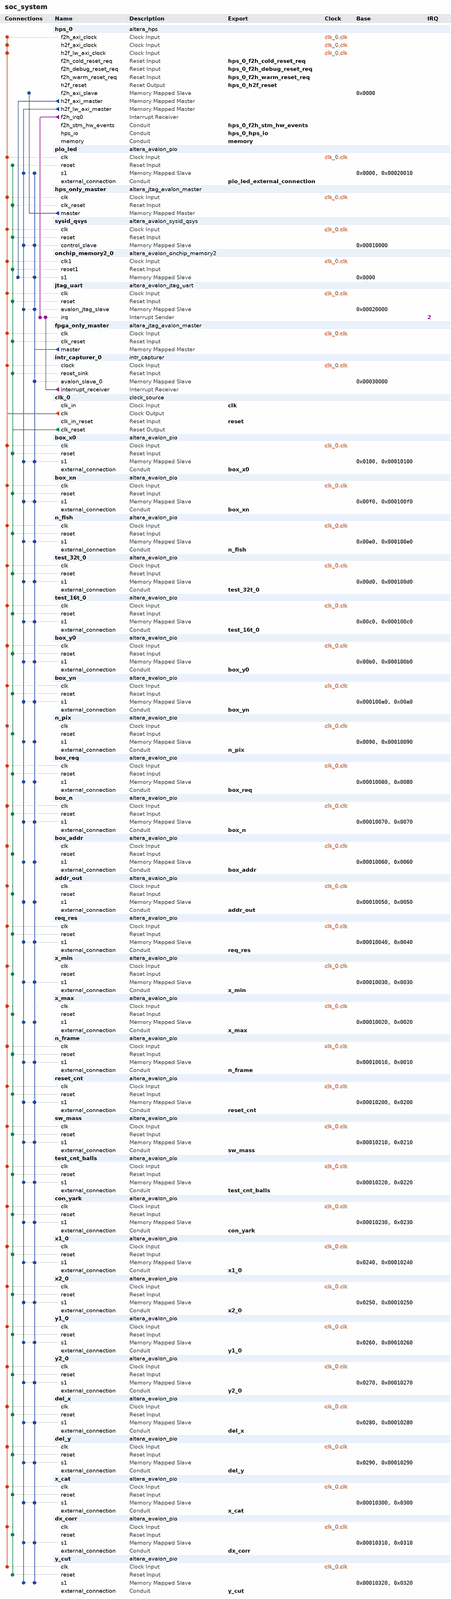
[diagram p0: system contents, whole]
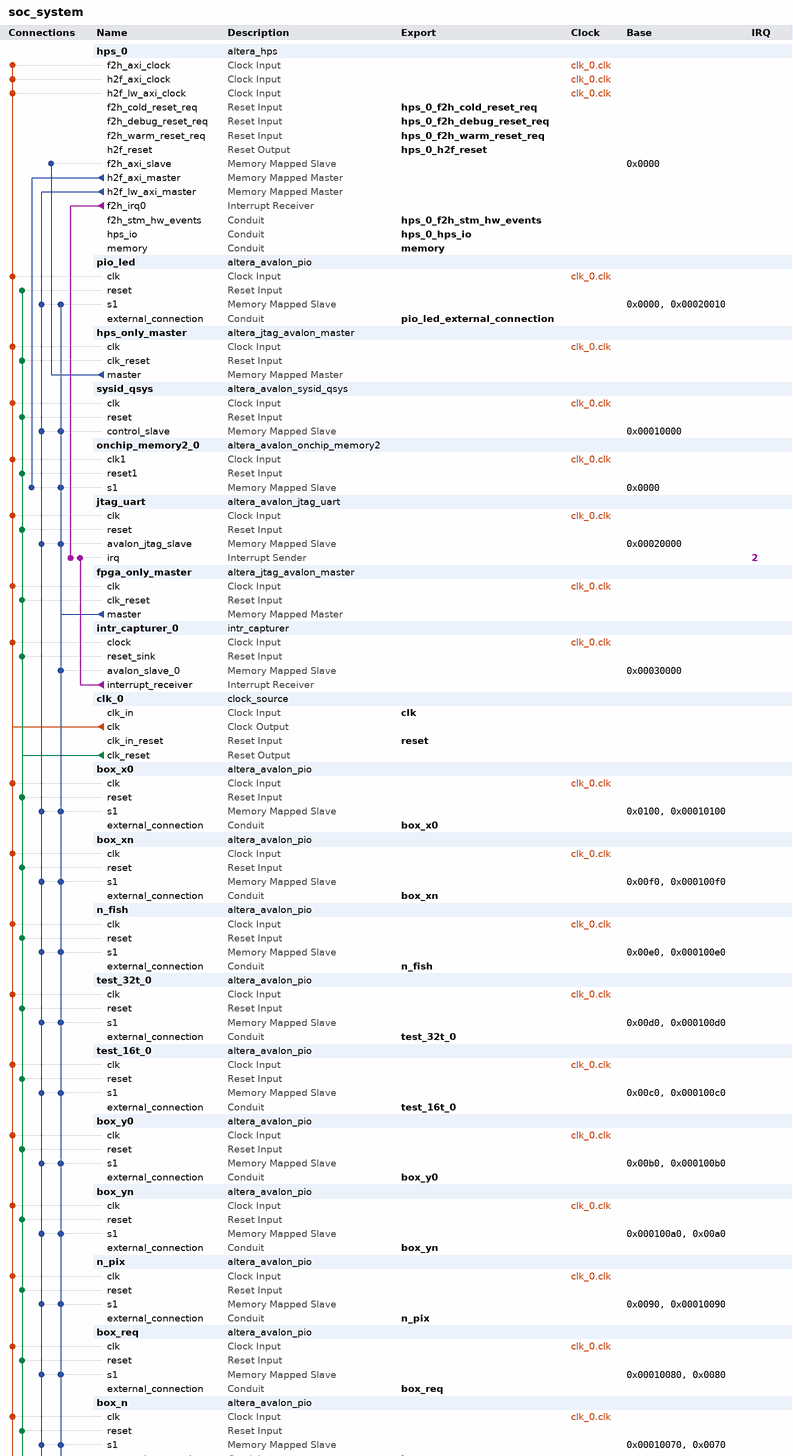
[diagram p1: system contents, upper part]
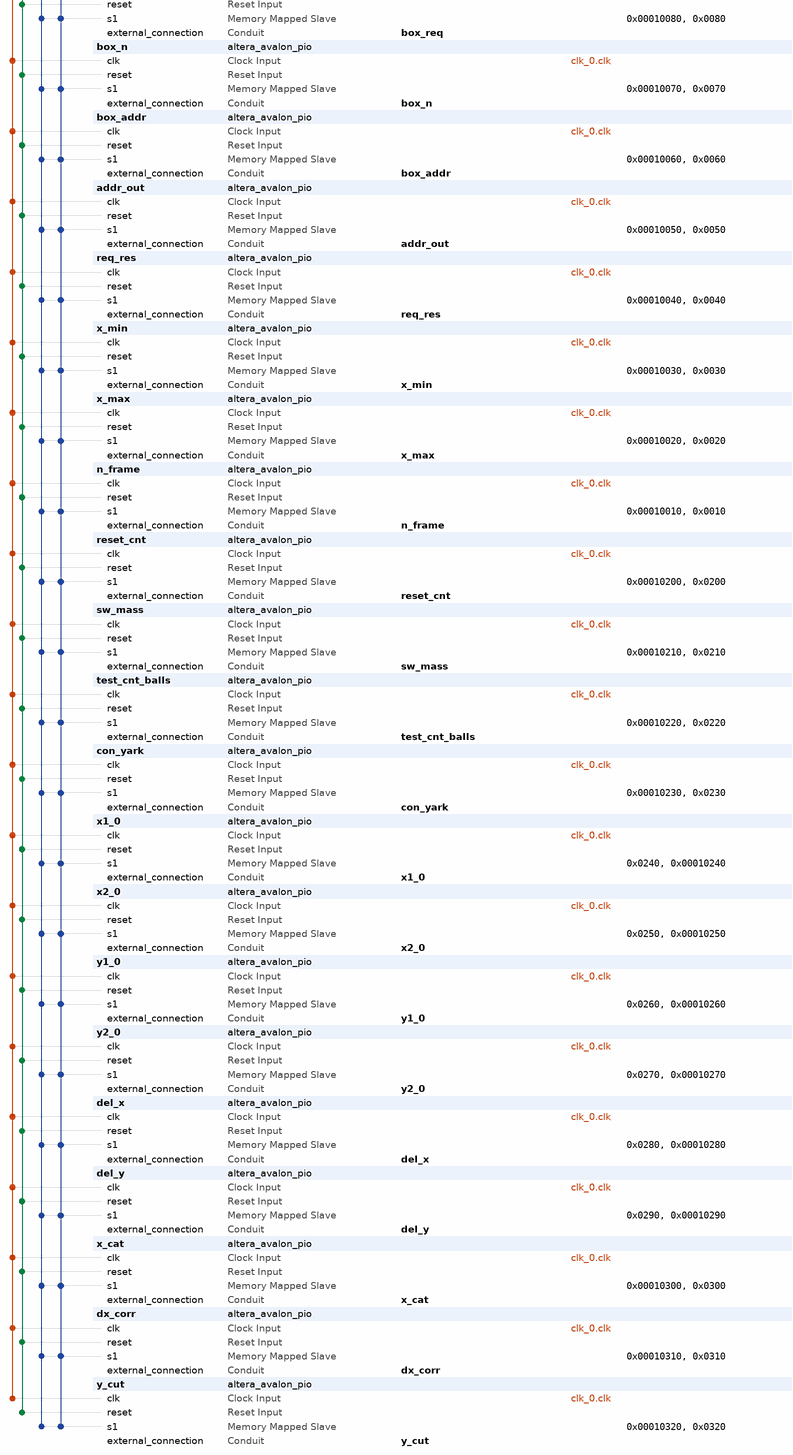
[diagram p2: system contents, lower part]
# Platform Designer (Qsys) system soc_system, Cyclone V 5CSEMA5F31C6
# Parameters at their usual value, and those the tool derives, are not listed.
package require -exact qsys 13.1
create_system soc_system
set_project_property DEVICE_FAMILY {Cyclone V}
set_project_property DEVICE 5CSEMA5F31C6

add_instance hps_0 altera_hps 13.1
set_instance_parameter_value hps_0 MEM_VENDOR JEDEC
set_instance_parameter_value hps_0 MEM_ROW_ADDR_WIDTH 15
set_instance_parameter_value hps_0 MEM_COL_ADDR_WIDTH 10
set_instance_parameter_value hps_0 MEM_DQ_WIDTH 32
set_instance_parameter_value hps_0 MEM_BANKADDR_WIDTH 3
set_instance_parameter_value hps_0 MEM_DRV_STR RZQ/7
set_instance_parameter_value hps_0 MEM_RTT_NOM RZQ/4
set_instance_parameter_value hps_0 MEM_RTT_WR RZQ/4
set_instance_parameter_value hps_0 MEM_WTCL 8
set_instance_parameter_value hps_0 MEM_TCL 11
set_instance_parameter_value hps_0 TIMING_TIS 180
set_instance_parameter_value hps_0 TIMING_TIH 140
set_instance_parameter_value hps_0 TIMING_TDS 30
set_instance_parameter_value hps_0 TIMING_TDH 65
set_instance_parameter_value hps_0 TIMING_TDQSQ 125
set_instance_parameter_value hps_0 TIMING_TDQSCK 255
set_instance_parameter_value hps_0 TIMING_TQSH 0.4
set_instance_parameter_value hps_0 MEM_TRAS_NS 35.0
set_instance_parameter_value hps_0 MEM_TRCD_NS 13.75
set_instance_parameter_value hps_0 MEM_TRP_NS 13.75
set_instance_parameter_value hps_0 MEM_TRFC_NS 260.0
set_instance_parameter_value hps_0 MEM_TFAW_NS 30.0
set_instance_parameter_value hps_0 REF_CLK_FREQ 25.0
set_instance_parameter_value hps_0 DEFAULT_FAST_SIM_MODEL true
set_instance_parameter_value hps_0 TIMING_BOARD_MAX_CK_DELAY 0.03
set_instance_parameter_value hps_0 TIMING_BOARD_MAX_DQS_DELAY 0.02
set_instance_parameter_value hps_0 TIMING_BOARD_SKEW_CKDQS_DIMM_MIN 0.09
set_instance_parameter_value hps_0 TIMING_BOARD_SKEW_CKDQS_DIMM_MAX 0.16
set_instance_parameter_value hps_0 TIMING_BOARD_SKEW_WITHIN_DQS 0.01
set_instance_parameter_value hps_0 TIMING_BOARD_SKEW_BETWEEN_DQS 0.08
set_instance_parameter_value hps_0 TIMING_BOARD_DQ_TO_DQS_SKEW 0.0
set_instance_parameter_value hps_0 TIMING_BOARD_AC_SKEW 0.03
set_instance_parameter_value hps_0 TIMING_BOARD_AC_TO_CK_SKEW 0.0
set_instance_parameter_value hps_0 MEM_CLK_FREQ 400.0
set_instance_parameter_value hps_0 HPS_PROTOCOL DDR3
set_instance_parameter_value hps_0 STM_Enable true
set_instance_parameter_value hps_0 F2S_Width 2
set_instance_parameter_value hps_0 S2F_Width 2
set_instance_parameter_value hps_0 LWH2F_Enable true
set_instance_parameter_value hps_0 F2SCLK_DBGRST_Enable true
set_instance_parameter_value hps_0 F2SCLK_WARMRST_Enable true
set_instance_parameter_value hps_0 F2SCLK_COLDRST_Enable true
set_instance_parameter_value hps_0 F2SINTERRUPT_Enable true
set_instance_parameter_value hps_0 EMAC1_PinMuxing {HPS I/O Set 0}
set_instance_parameter_value hps_0 EMAC1_Mode RGMII
set_instance_parameter_value hps_0 QSPI_PinMuxing {HPS I/O Set 0}
set_instance_parameter_value hps_0 QSPI_Mode {1 SS}
set_instance_parameter_value hps_0 SDIO_PinMuxing {HPS I/O Set 0}
set_instance_parameter_value hps_0 SDIO_Mode {4-bit Data}
set_instance_parameter_value hps_0 USB1_PinMuxing {HPS I/O Set 0}
set_instance_parameter_value hps_0 USB1_Mode SDR
set_instance_parameter_value hps_0 SPIM1_PinMuxing {HPS I/O Set 0}
set_instance_parameter_value hps_0 SPIM1_Mode {Single Slave Select}
set_instance_parameter_value hps_0 UART0_PinMuxing {HPS I/O Set 0}
set_instance_parameter_value hps_0 UART0_Mode {No Flow Control}
set_instance_parameter_value hps_0 I2C0_PinMuxing {HPS I/O Set 0}
set_instance_parameter_value hps_0 I2C0_Mode I2C
set_instance_parameter_value hps_0 I2C1_PinMuxing {HPS I/O Set 0}
set_instance_parameter_value hps_0 I2C1_Mode I2C
set_instance_parameter_value hps_0 S2FCLK_USER1CLK_FREQ 100
set_instance_parameter_value hps_0 FPGA_PERIPHERAL_OUTPUT_CLOCK_FREQ_EMAC0_MD_CLK 100
set_instance_parameter_value hps_0 FPGA_PERIPHERAL_OUTPUT_CLOCK_FREQ_EMAC0_GTX_CLK 100
set_instance_parameter_value hps_0 FPGA_PERIPHERAL_OUTPUT_CLOCK_FREQ_EMAC1_MD_CLK 100
set_instance_parameter_value hps_0 FPGA_PERIPHERAL_OUTPUT_CLOCK_FREQ_EMAC1_GTX_CLK 100

add_instance pio_led altera_avalon_pio 13.1
set_instance_parameter_value pio_led direction Output
set_instance_parameter_value pio_led width 10

add_instance hps_only_master altera_jtag_avalon_master 13.1

add_instance sysid_qsys altera_avalon_sysid_qsys 13.1
set_instance_parameter_value sysid_qsys id -1395322110

add_instance onchip_memory2_0 altera_avalon_onchip_memory2 13.1
set_instance_parameter_value onchip_memory2_0 dataWidth 64
set_instance_parameter_value onchip_memory2_0 dualPort false
set_instance_parameter_value onchip_memory2_0 initMemContent true
set_instance_parameter_value onchip_memory2_0 initializationFileName onchip_memory2_0
set_instance_parameter_value onchip_memory2_0 memorySize 65536

add_instance jtag_uart altera_avalon_jtag_uart 13.1
set_instance_parameter_value jtag_uart allowMultipleConnections true
set_instance_parameter_value jtag_uart simInteractiveOptions INTERACTIVE_ASCII_OUTPUT

add_instance fpga_only_master altera_jtag_avalon_master 13.1

add_instance intr_capturer_0 intr_capturer 100.99.98.97

add_instance clk_0 clock_source 13.1
set_instance_parameter_value clk_0 clockFrequency 56000000

add_instance box_x0 altera_avalon_pio 13.1
set_instance_parameter_value box_x0 captureEdge true
set_instance_parameter_value box_x0 direction Input
set_instance_parameter_value box_x0 edgeType ANY
set_instance_parameter_value box_x0 irqType EDGE
set_instance_parameter_value box_x0 width 16

add_instance box_xn altera_avalon_pio 13.1
set_instance_parameter_value box_xn captureEdge true
set_instance_parameter_value box_xn direction Input
set_instance_parameter_value box_xn edgeType ANY
set_instance_parameter_value box_xn width 16

add_instance n_fish altera_avalon_pio 13.1
set_instance_parameter_value n_fish direction Output
set_instance_parameter_value n_fish width 16

add_instance test_32t_0 altera_avalon_pio 13.1
set_instance_parameter_value test_32t_0 direction Output
set_instance_parameter_value test_32t_0 width 32

add_instance test_16t_0 altera_avalon_pio 13.1
set_instance_parameter_value test_16t_0 direction Output
set_instance_parameter_value test_16t_0 width 16

add_instance box_y0 altera_avalon_pio 13.1
set_instance_parameter_value box_y0 captureEdge true
set_instance_parameter_value box_y0 direction Input
set_instance_parameter_value box_y0 edgeType ANY
set_instance_parameter_value box_y0 irqType EDGE
set_instance_parameter_value box_y0 width 16

add_instance box_yn altera_avalon_pio 13.1
set_instance_parameter_value box_yn captureEdge true
set_instance_parameter_value box_yn direction Input
set_instance_parameter_value box_yn edgeType ANY
set_instance_parameter_value box_yn irqType EDGE
set_instance_parameter_value box_yn width 16

add_instance n_pix altera_avalon_pio 13.1
set_instance_parameter_value n_pix captureEdge true
set_instance_parameter_value n_pix direction Input
set_instance_parameter_value n_pix edgeType ANY
set_instance_parameter_value n_pix irqType EDGE
set_instance_parameter_value n_pix width 32

add_instance box_req altera_avalon_pio 13.1
set_instance_parameter_value box_req captureEdge true
set_instance_parameter_value box_req direction Input
set_instance_parameter_value box_req width 1

add_instance box_n altera_avalon_pio 13.1
set_instance_parameter_value box_n direction Input
set_instance_parameter_value box_n width 8

add_instance box_addr altera_avalon_pio 13.1
set_instance_parameter_value box_addr direction Input
set_instance_parameter_value box_addr width 8

add_instance addr_out altera_avalon_pio 13.1
set_instance_parameter_value addr_out direction Output
set_instance_parameter_value addr_out width 8

add_instance req_res altera_avalon_pio 13.1
set_instance_parameter_value req_res direction Output
set_instance_parameter_value req_res width 1

add_instance x_min altera_avalon_pio 13.1
set_instance_parameter_value x_min direction Input
set_instance_parameter_value x_min width 16

add_instance x_max altera_avalon_pio 13.1
set_instance_parameter_value x_max direction Input
set_instance_parameter_value x_max width 16

add_instance n_frame altera_avalon_pio 13.1
set_instance_parameter_value n_frame direction Input
set_instance_parameter_value n_frame width 32

add_instance reset_cnt altera_avalon_pio 13.1
set_instance_parameter_value reset_cnt direction Input
set_instance_parameter_value reset_cnt width 1

add_instance sw_mass altera_avalon_pio 13.1
set_instance_parameter_value sw_mass direction Input
set_instance_parameter_value sw_mass width 2

add_instance test_cnt_balls altera_avalon_pio 13.1
set_instance_parameter_value test_cnt_balls direction Input
set_instance_parameter_value test_cnt_balls width 1

add_instance con_yark altera_avalon_pio 13.1
set_instance_parameter_value con_yark direction Output
set_instance_parameter_value con_yark width 8

add_instance x1_0 altera_avalon_pio 13.1
set_instance_parameter_value x1_0 direction Output
set_instance_parameter_value x1_0 width 10

add_instance x2_0 altera_avalon_pio 13.1
set_instance_parameter_value x2_0 direction Output
set_instance_parameter_value x2_0 width 10

add_instance y1_0 altera_avalon_pio 13.1
set_instance_parameter_value y1_0 direction Output
set_instance_parameter_value y1_0 width 10

add_instance y2_0 altera_avalon_pio 13.1
set_instance_parameter_value y2_0 direction Output
set_instance_parameter_value y2_0 width 10

add_instance del_x altera_avalon_pio 13.1
set_instance_parameter_value del_x direction Output
set_instance_parameter_value del_x width 10

add_instance del_y altera_avalon_pio 13.1
set_instance_parameter_value del_y direction Output
set_instance_parameter_value del_y width 10

add_instance x_cat altera_avalon_pio 13.1
set_instance_parameter_value x_cat direction Output
set_instance_parameter_value x_cat width 10

add_instance dx_corr altera_avalon_pio 13.1
set_instance_parameter_value dx_corr direction Input
set_instance_parameter_value dx_corr width 10

add_instance y_cut altera_avalon_pio 13.1
set_instance_parameter_value y_cut direction Output
set_instance_parameter_value y_cut width 10

# connections
add_connection clk_0.clk addr_out.clk clock
add_connection clk_0.clk box_addr.clk clock
add_connection clk_0.clk box_n.clk clock
add_connection clk_0.clk box_req.clk clock
add_connection clk_0.clk box_x0.clk clock
add_connection clk_0.clk box_xn.clk clock
add_connection clk_0.clk box_y0.clk clock
add_connection clk_0.clk box_yn.clk clock
add_connection clk_0.clk con_yark.clk clock
add_connection clk_0.clk del_x.clk clock
add_connection clk_0.clk del_y.clk clock
add_connection clk_0.clk dx_corr.clk clock
add_connection clk_0.clk fpga_only_master.clk clock
add_connection clk_0.clk hps_0.f2h_axi_clock clock
add_connection clk_0.clk hps_0.h2f_axi_clock clock
add_connection clk_0.clk hps_0.h2f_lw_axi_clock clock
add_connection clk_0.clk hps_only_master.clk clock
add_connection clk_0.clk intr_capturer_0.clock clock
add_connection clk_0.clk jtag_uart.clk clock
add_connection clk_0.clk n_fish.clk clock
add_connection clk_0.clk n_frame.clk clock
add_connection clk_0.clk n_pix.clk clock
add_connection clk_0.clk onchip_memory2_0.clk1 clock
add_connection clk_0.clk pio_led.clk clock
add_connection clk_0.clk req_res.clk clock
add_connection clk_0.clk reset_cnt.clk clock
add_connection clk_0.clk sw_mass.clk clock
add_connection clk_0.clk sysid_qsys.clk clock
add_connection clk_0.clk test_16t_0.clk clock
add_connection clk_0.clk test_32t_0.clk clock
add_connection clk_0.clk test_cnt_balls.clk clock
add_connection clk_0.clk x1_0.clk clock
add_connection clk_0.clk x2_0.clk clock
add_connection clk_0.clk x_cat.clk clock
add_connection clk_0.clk x_max.clk clock
add_connection clk_0.clk x_min.clk clock
add_connection clk_0.clk y1_0.clk clock
add_connection clk_0.clk y2_0.clk clock
add_connection clk_0.clk y_cut.clk clock
add_connection clk_0.clk_reset addr_out.reset reset
add_connection clk_0.clk_reset box_addr.reset reset
add_connection clk_0.clk_reset box_n.reset reset
add_connection clk_0.clk_reset box_req.reset reset
add_connection clk_0.clk_reset box_x0.reset reset
add_connection clk_0.clk_reset box_xn.reset reset
add_connection clk_0.clk_reset box_y0.reset reset
add_connection clk_0.clk_reset box_yn.reset reset
add_connection clk_0.clk_reset con_yark.reset reset
add_connection clk_0.clk_reset del_x.reset reset
add_connection clk_0.clk_reset del_y.reset reset
add_connection clk_0.clk_reset dx_corr.reset reset
add_connection clk_0.clk_reset fpga_only_master.clk_reset reset
add_connection clk_0.clk_reset hps_only_master.clk_reset reset
add_connection clk_0.clk_reset intr_capturer_0.reset_sink reset
add_connection clk_0.clk_reset jtag_uart.reset reset
add_connection clk_0.clk_reset n_fish.reset reset
add_connection clk_0.clk_reset n_frame.reset reset
add_connection clk_0.clk_reset n_pix.reset reset
add_connection clk_0.clk_reset onchip_memory2_0.reset1 reset
add_connection clk_0.clk_reset pio_led.reset reset
add_connection clk_0.clk_reset req_res.reset reset
add_connection clk_0.clk_reset reset_cnt.reset reset
add_connection clk_0.clk_reset sw_mass.reset reset
add_connection clk_0.clk_reset sysid_qsys.reset reset
add_connection clk_0.clk_reset test_16t_0.reset reset
add_connection clk_0.clk_reset test_32t_0.reset reset
add_connection clk_0.clk_reset test_cnt_balls.reset reset
add_connection clk_0.clk_reset x1_0.reset reset
add_connection clk_0.clk_reset x2_0.reset reset
add_connection clk_0.clk_reset x_cat.reset reset
add_connection clk_0.clk_reset x_max.reset reset
add_connection clk_0.clk_reset x_min.reset reset
add_connection clk_0.clk_reset y1_0.reset reset
add_connection clk_0.clk_reset y2_0.reset reset
add_connection clk_0.clk_reset y_cut.reset reset
add_connection fpga_only_master.master addr_out.s1 avalon
set_connection_parameter_value fpga_only_master.master/addr_out.s1 baseAddress 0x00010050
add_connection fpga_only_master.master box_addr.s1 avalon
set_connection_parameter_value fpga_only_master.master/box_addr.s1 baseAddress 0x00010060
add_connection fpga_only_master.master box_n.s1 avalon
set_connection_parameter_value fpga_only_master.master/box_n.s1 baseAddress 0x00010070
add_connection fpga_only_master.master box_req.s1 avalon
set_connection_parameter_value fpga_only_master.master/box_req.s1 baseAddress 0x00010080
add_connection fpga_only_master.master box_x0.s1 avalon
set_connection_parameter_value fpga_only_master.master/box_x0.s1 baseAddress 0x00010100
add_connection fpga_only_master.master box_xn.s1 avalon
set_connection_parameter_value fpga_only_master.master/box_xn.s1 baseAddress 0x000100f0
add_connection fpga_only_master.master box_y0.s1 avalon
set_connection_parameter_value fpga_only_master.master/box_y0.s1 baseAddress 0x000100b0
add_connection fpga_only_master.master box_yn.s1 avalon
set_connection_parameter_value fpga_only_master.master/box_yn.s1 baseAddress 0x000100a0
add_connection fpga_only_master.master con_yark.s1 avalon
set_connection_parameter_value fpga_only_master.master/con_yark.s1 baseAddress 0x00010230
add_connection fpga_only_master.master del_x.s1 avalon
set_connection_parameter_value fpga_only_master.master/del_x.s1 baseAddress 0x00010280
add_connection fpga_only_master.master del_y.s1 avalon
set_connection_parameter_value fpga_only_master.master/del_y.s1 baseAddress 0x00010290
add_connection fpga_only_master.master dx_corr.s1 avalon
set_connection_parameter_value fpga_only_master.master/dx_corr.s1 baseAddress 0x00010310
add_connection fpga_only_master.master intr_capturer_0.avalon_slave_0 avalon
set_connection_parameter_value fpga_only_master.master/intr_capturer_0.avalon_slave_0 baseAddress 0x00030000
add_connection fpga_only_master.master jtag_uart.avalon_jtag_slave avalon
set_connection_parameter_value fpga_only_master.master/jtag_uart.avalon_jtag_slave baseAddress 0x00020000
add_connection fpga_only_master.master n_fish.s1 avalon
set_connection_parameter_value fpga_only_master.master/n_fish.s1 baseAddress 0x000100e0
add_connection fpga_only_master.master n_frame.s1 avalon
set_connection_parameter_value fpga_only_master.master/n_frame.s1 baseAddress 0x00010010
add_connection fpga_only_master.master n_pix.s1 avalon
set_connection_parameter_value fpga_only_master.master/n_pix.s1 baseAddress 0x00010090
add_connection fpga_only_master.master onchip_memory2_0.s1 avalon
set_connection_parameter_value fpga_only_master.master/onchip_memory2_0.s1 baseAddress 0x0000
add_connection fpga_only_master.master pio_led.s1 avalon
set_connection_parameter_value fpga_only_master.master/pio_led.s1 baseAddress 0x00020010
add_connection fpga_only_master.master req_res.s1 avalon
set_connection_parameter_value fpga_only_master.master/req_res.s1 baseAddress 0x00010040
add_connection fpga_only_master.master reset_cnt.s1 avalon
set_connection_parameter_value fpga_only_master.master/reset_cnt.s1 baseAddress 0x00010200
add_connection fpga_only_master.master sw_mass.s1 avalon
set_connection_parameter_value fpga_only_master.master/sw_mass.s1 baseAddress 0x00010210
add_connection fpga_only_master.master sysid_qsys.control_slave avalon
set_connection_parameter_value fpga_only_master.master/sysid_qsys.control_slave baseAddress 0x00010000
add_connection fpga_only_master.master test_16t_0.s1 avalon
set_connection_parameter_value fpga_only_master.master/test_16t_0.s1 baseAddress 0x000100c0
add_connection fpga_only_master.master test_32t_0.s1 avalon
set_connection_parameter_value fpga_only_master.master/test_32t_0.s1 baseAddress 0x000100d0
add_connection fpga_only_master.master test_cnt_balls.s1 avalon
set_connection_parameter_value fpga_only_master.master/test_cnt_balls.s1 baseAddress 0x00010220
add_connection fpga_only_master.master x1_0.s1 avalon
set_connection_parameter_value fpga_only_master.master/x1_0.s1 baseAddress 0x00010240
add_connection fpga_only_master.master x2_0.s1 avalon
set_connection_parameter_value fpga_only_master.master/x2_0.s1 baseAddress 0x00010250
add_connection fpga_only_master.master x_cat.s1 avalon
set_connection_parameter_value fpga_only_master.master/x_cat.s1 baseAddress 0x00010300
add_connection fpga_only_master.master x_max.s1 avalon
set_connection_parameter_value fpga_only_master.master/x_max.s1 baseAddress 0x00010020
add_connection fpga_only_master.master x_min.s1 avalon
set_connection_parameter_value fpga_only_master.master/x_min.s1 baseAddress 0x00010030
add_connection fpga_only_master.master y1_0.s1 avalon
set_connection_parameter_value fpga_only_master.master/y1_0.s1 baseAddress 0x00010260
add_connection fpga_only_master.master y2_0.s1 avalon
set_connection_parameter_value fpga_only_master.master/y2_0.s1 baseAddress 0x00010270
add_connection fpga_only_master.master y_cut.s1 avalon
set_connection_parameter_value fpga_only_master.master/y_cut.s1 baseAddress 0x00010320
add_connection hps_0.h2f_axi_master onchip_memory2_0.s1 avalon
set_connection_parameter_value hps_0.h2f_axi_master/onchip_memory2_0.s1 baseAddress 0x0000
add_connection hps_0.h2f_lw_axi_master addr_out.s1 avalon
set_connection_parameter_value hps_0.h2f_lw_axi_master/addr_out.s1 baseAddress 0x0050
add_connection hps_0.h2f_lw_axi_master box_addr.s1 avalon
set_connection_parameter_value hps_0.h2f_lw_axi_master/box_addr.s1 baseAddress 0x0060
add_connection hps_0.h2f_lw_axi_master box_n.s1 avalon
set_connection_parameter_value hps_0.h2f_lw_axi_master/box_n.s1 baseAddress 0x0070
add_connection hps_0.h2f_lw_axi_master box_req.s1 avalon
set_connection_parameter_value hps_0.h2f_lw_axi_master/box_req.s1 baseAddress 0x0080
add_connection hps_0.h2f_lw_axi_master box_x0.s1 avalon
set_connection_parameter_value hps_0.h2f_lw_axi_master/box_x0.s1 baseAddress 0x0100
add_connection hps_0.h2f_lw_axi_master box_xn.s1 avalon
set_connection_parameter_value hps_0.h2f_lw_axi_master/box_xn.s1 baseAddress 0x00f0
add_connection hps_0.h2f_lw_axi_master box_y0.s1 avalon
set_connection_parameter_value hps_0.h2f_lw_axi_master/box_y0.s1 baseAddress 0x00b0
add_connection hps_0.h2f_lw_axi_master box_yn.s1 avalon
set_connection_parameter_value hps_0.h2f_lw_axi_master/box_yn.s1 baseAddress 0x00a0
add_connection hps_0.h2f_lw_axi_master con_yark.s1 avalon
set_connection_parameter_value hps_0.h2f_lw_axi_master/con_yark.s1 baseAddress 0x0230
add_connection hps_0.h2f_lw_axi_master del_x.s1 avalon
set_connection_parameter_value hps_0.h2f_lw_axi_master/del_x.s1 baseAddress 0x0280
add_connection hps_0.h2f_lw_axi_master del_y.s1 avalon
set_connection_parameter_value hps_0.h2f_lw_axi_master/del_y.s1 baseAddress 0x0290
add_connection hps_0.h2f_lw_axi_master dx_corr.s1 avalon
set_connection_parameter_value hps_0.h2f_lw_axi_master/dx_corr.s1 baseAddress 0x0310
add_connection hps_0.h2f_lw_axi_master jtag_uart.avalon_jtag_slave avalon
set_connection_parameter_value hps_0.h2f_lw_axi_master/jtag_uart.avalon_jtag_slave baseAddress 0x00020000
add_connection hps_0.h2f_lw_axi_master n_fish.s1 avalon
set_connection_parameter_value hps_0.h2f_lw_axi_master/n_fish.s1 baseAddress 0x00e0
add_connection hps_0.h2f_lw_axi_master n_frame.s1 avalon
set_connection_parameter_value hps_0.h2f_lw_axi_master/n_frame.s1 baseAddress 0x0010
add_connection hps_0.h2f_lw_axi_master n_pix.s1 avalon
set_connection_parameter_value hps_0.h2f_lw_axi_master/n_pix.s1 baseAddress 0x0090
add_connection hps_0.h2f_lw_axi_master pio_led.s1 avalon
set_connection_parameter_value hps_0.h2f_lw_axi_master/pio_led.s1 baseAddress 0x0000
add_connection hps_0.h2f_lw_axi_master req_res.s1 avalon
set_connection_parameter_value hps_0.h2f_lw_axi_master/req_res.s1 baseAddress 0x0040
add_connection hps_0.h2f_lw_axi_master reset_cnt.s1 avalon
set_connection_parameter_value hps_0.h2f_lw_axi_master/reset_cnt.s1 baseAddress 0x0200
add_connection hps_0.h2f_lw_axi_master sw_mass.s1 avalon
set_connection_parameter_value hps_0.h2f_lw_axi_master/sw_mass.s1 baseAddress 0x0210
add_connection hps_0.h2f_lw_axi_master sysid_qsys.control_slave avalon
set_connection_parameter_value hps_0.h2f_lw_axi_master/sysid_qsys.control_slave baseAddress 0x00010000
add_connection hps_0.h2f_lw_axi_master test_16t_0.s1 avalon
set_connection_parameter_value hps_0.h2f_lw_axi_master/test_16t_0.s1 baseAddress 0x00c0
add_connection hps_0.h2f_lw_axi_master test_32t_0.s1 avalon
set_connection_parameter_value hps_0.h2f_lw_axi_master/test_32t_0.s1 baseAddress 0x00d0
add_connection hps_0.h2f_lw_axi_master test_cnt_balls.s1 avalon
set_connection_parameter_value hps_0.h2f_lw_axi_master/test_cnt_balls.s1 baseAddress 0x0220
add_connection hps_0.h2f_lw_axi_master x1_0.s1 avalon
set_connection_parameter_value hps_0.h2f_lw_axi_master/x1_0.s1 baseAddress 0x0240
add_connection hps_0.h2f_lw_axi_master x2_0.s1 avalon
set_connection_parameter_value hps_0.h2f_lw_axi_master/x2_0.s1 baseAddress 0x0250
add_connection hps_0.h2f_lw_axi_master x_cat.s1 avalon
set_connection_parameter_value hps_0.h2f_lw_axi_master/x_cat.s1 baseAddress 0x0300
add_connection hps_0.h2f_lw_axi_master x_max.s1 avalon
set_connection_parameter_value hps_0.h2f_lw_axi_master/x_max.s1 baseAddress 0x0020
add_connection hps_0.h2f_lw_axi_master x_min.s1 avalon
set_connection_parameter_value hps_0.h2f_lw_axi_master/x_min.s1 baseAddress 0x0030
add_connection hps_0.h2f_lw_axi_master y1_0.s1 avalon
set_connection_parameter_value hps_0.h2f_lw_axi_master/y1_0.s1 baseAddress 0x0260
add_connection hps_0.h2f_lw_axi_master y2_0.s1 avalon
set_connection_parameter_value hps_0.h2f_lw_axi_master/y2_0.s1 baseAddress 0x0270
add_connection hps_0.h2f_lw_axi_master y_cut.s1 avalon
set_connection_parameter_value hps_0.h2f_lw_axi_master/y_cut.s1 baseAddress 0x0320
add_connection hps_only_master.master hps_0.f2h_axi_slave avalon
set_connection_parameter_value hps_only_master.master/hps_0.f2h_axi_slave baseAddress 0x0000
add_connection hps_0.f2h_irq0 jtag_uart.irq interrupt
set_connection_parameter_value hps_0.f2h_irq0/jtag_uart.irq irqNumber 2
add_connection intr_capturer_0.interrupt_receiver jtag_uart.irq interrupt
set_connection_parameter_value intr_capturer_0.interrupt_receiver/jtag_uart.irq irqNumber 2

# exported interfaces
add_interface clk clock sink
set_interface_property clk EXPORT_OF clk_0.clk_in
add_interface reset reset sink
set_interface_property reset EXPORT_OF clk_0.clk_in_reset
add_interface memory conduit end
set_interface_property memory EXPORT_OF hps_0.memory
add_interface hps_0_hps_io conduit end
set_interface_property hps_0_hps_io EXPORT_OF hps_0.hps_io
add_interface hps_0_h2f_reset reset source
set_interface_property hps_0_h2f_reset EXPORT_OF hps_0.h2f_reset
add_interface hps_0_f2h_stm_hw_events conduit end
set_interface_property hps_0_f2h_stm_hw_events EXPORT_OF hps_0.f2h_stm_hw_events
add_interface hps_0_f2h_warm_reset_req reset sink
set_interface_property hps_0_f2h_warm_reset_req EXPORT_OF hps_0.f2h_warm_reset_req
add_interface hps_0_f2h_debug_reset_req reset sink
set_interface_property hps_0_f2h_debug_reset_req EXPORT_OF hps_0.f2h_debug_reset_req
add_interface hps_0_f2h_cold_reset_req reset sink
set_interface_property hps_0_f2h_cold_reset_req EXPORT_OF hps_0.f2h_cold_reset_req
add_interface pio_led_external_connection conduit end
set_interface_property pio_led_external_connection EXPORT_OF pio_led.external_connection
add_interface box_x0 conduit end
set_interface_property box_x0 EXPORT_OF box_x0.external_connection
add_interface box_xn conduit end
set_interface_property box_xn EXPORT_OF box_xn.external_connection
add_interface n_fish conduit end
set_interface_property n_fish EXPORT_OF n_fish.external_connection
add_interface test_32t_0 conduit end
set_interface_property test_32t_0 EXPORT_OF test_32t_0.external_connection
add_interface test_16t_0 conduit end
set_interface_property test_16t_0 EXPORT_OF test_16t_0.external_connection
add_interface box_yn conduit end
set_interface_property box_yn EXPORT_OF box_yn.external_connection
add_interface n_pix conduit end
set_interface_property n_pix EXPORT_OF n_pix.external_connection
add_interface box_y0 conduit end
set_interface_property box_y0 EXPORT_OF box_y0.external_connection
add_interface box_req conduit end
set_interface_property box_req EXPORT_OF box_req.external_connection
add_interface box_n conduit end
set_interface_property box_n EXPORT_OF box_n.external_connection
add_interface box_addr conduit end
set_interface_property box_addr EXPORT_OF box_addr.external_connection
add_interface addr_out conduit end
set_interface_property addr_out EXPORT_OF addr_out.external_connection
add_interface req_res conduit end
set_interface_property req_res EXPORT_OF req_res.external_connection
add_interface x_min conduit end
set_interface_property x_min EXPORT_OF x_min.external_connection
add_interface x_max conduit end
set_interface_property x_max EXPORT_OF x_max.external_connection
add_interface n_frame conduit end
set_interface_property n_frame EXPORT_OF n_frame.external_connection
add_interface reset_cnt conduit end
set_interface_property reset_cnt EXPORT_OF reset_cnt.external_connection
add_interface sw_mass conduit end
set_interface_property sw_mass EXPORT_OF sw_mass.external_connection
add_interface test_cnt_balls conduit end
set_interface_property test_cnt_balls EXPORT_OF test_cnt_balls.external_connection
add_interface con_yark conduit end
set_interface_property con_yark EXPORT_OF con_yark.external_connection
add_interface del_y conduit end
set_interface_property del_y EXPORT_OF del_y.external_connection
add_interface del_x conduit end
set_interface_property del_x EXPORT_OF del_x.external_connection
add_interface y2_0 conduit end
set_interface_property y2_0 EXPORT_OF y2_0.external_connection
add_interface y1_0 conduit end
set_interface_property y1_0 EXPORT_OF y1_0.external_connection
add_interface x2_0 conduit end
set_interface_property x2_0 EXPORT_OF x2_0.external_connection
add_interface x1_0 conduit end
set_interface_property x1_0 EXPORT_OF x1_0.external_connection
add_interface x_cat conduit end
set_interface_property x_cat EXPORT_OF x_cat.external_connection
add_interface dx_corr conduit end
set_interface_property dx_corr EXPORT_OF dx_corr.external_connection
add_interface y_cut conduit end
set_interface_property y_cut EXPORT_OF y_cut.external_connection

set_interconnect_requirement {$system} qsys_mm.clockCrossingAdapter HANDSHAKE
set_interconnect_requirement {$system} qsys_mm.maxAdditionalLatency 1

save_system soc_system.qsys
